# Altium schematic sheet Sheet2.SchDoc
size A3; SheetNumber: 1; SheetTotal: 1
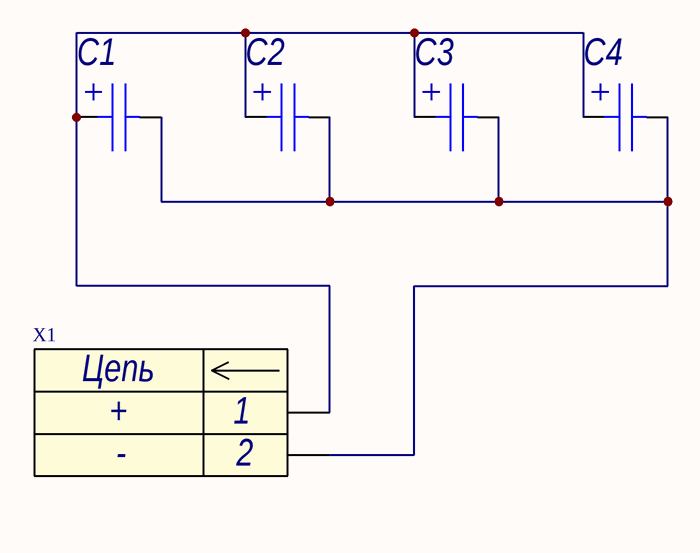
[diagram p0: Sheet2.SchDoc]

## Parts
C1  (no value)  [Cap R25 L40]
C2  (no value)  [Cap R25 L40]
C3  (no value)  [Cap R25 L40]
C4  (no value)  [Cap R25 L40]
X1  (no value)  [Contact_16AWG]

## Nets
NetC1_1: C1.1 C2.1 C3.1 C4.1 X1.1
NetC1_2: C1.2 C2.2 C3.2 C4.2 X1.2

## Notes on the sheet
- (in symbol Header_2_plg) Цепь

## Library data of the parts
C1-C4 = Capacitor electrolytic: Конденсатор пол.
X1 = Header_2_plg: Разъем - 2 конт. вилка; Contact_1: +; Contact_2: -